# EAGLE schematic espshield (EAGLE 7.2.0)
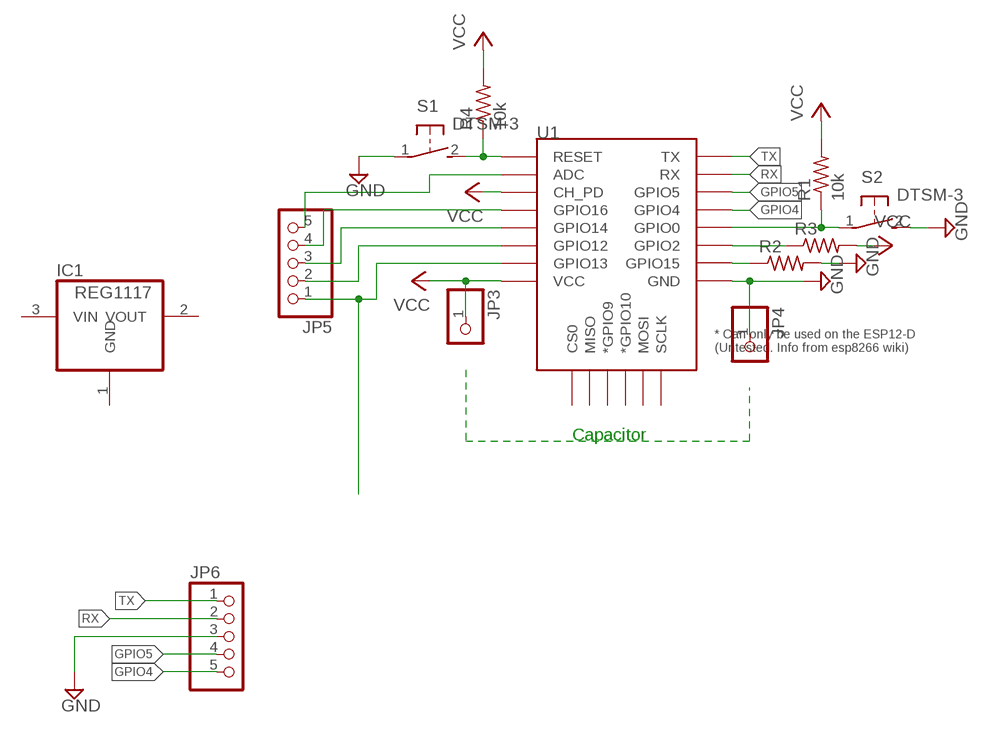
[diagram p0: schematic, sheet 1]

## Parts
IC1  REG1117  [SOT223]
JP3  PINHD-1X1  [1X01]
JP4  PINHD-1X1  [1X01]
JP5  PINHD-1X51X05_SMT  [1X05_SMT]
JP6  PINHD-1X51X05_SMT  [1X05_SMT]
R1  10k  R-US_R0805  [R0805]
R2  R-US_R0805  [R0805]
R3  R-US_R0805  [R0805]
R4  10k  R-US_R0805  [R0805]
S1  DTSM-3  [DTSM-3]
S2  DTSM-3  [DTSM-3]
U1  ESP12ESMD  [ESP12E-SMD]

## Nets
GND: JP4.1 JP6.3 R2.2 S1.1 S2.2 U1.GND
GPIO4: JP6.5 U1.GPIO4
GPIO5: JP6.4 U1.GPIO5
N$1: R1.1 S2.1 U1.GPIO0
N$3: R2.1 U1.GPIO15
N$4: R4.1 S1.2 U1.RESET
N$9: R3.1 U1.GPIO2
N$12: JP5.1 U1.GPIO13
N$13: JP5.2 U1.GPIO12
N$14: JP5.5 U1.ADC
N$15: JP5.3 U1.GPIO14
N$16: JP5.4 U1.GPIO16
RX: JP6.2 U1.RXD0(RX)
TX: JP6.1 U1.TXD0(TX)
VCC: JP3.1 R1.2 R3.2 R4.2 U1.CH_PD U1.VCC
Unconnected: IC1.2(VOUT) IC1.3(VIN) U1.CS0 U1.GPIO9(*GPIO9) U1.GPIO10(*GPIO10) U1.MISO U1.MOSI U1.SCLK

## Notes on the sheet
- Capacitor

## Power pins joined to a net without a drawn wire
GND: IC1.1(GND)

## Library data of the parts
IC1 = burr-brown:REG1117: 800mA and 1A Low Dropout (LDO) Positive Regulator 1.8V, 2.5V, 2.85V, 3.3V, 5V, and Adj; MPN: REG1117; OC_FARNELL: 1097566; OC_NEWARK: 14P6981
JP3 JP4 = pinhead+:PINHD-1X1: PIN HEADER
JP5 JP6 = pinhead+:PINHD-1X5: PIN HEADER
R1-R4 = rcl:R-US_: RESISTOR, American symbol
S1 S2 = switch-tact:DTSM-3
U1 = esp8266modules:ESP12E: ESP12E Module